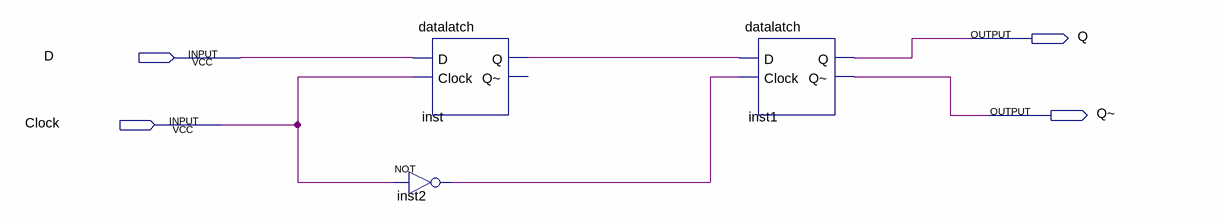
[diagram p0: schematic sheet]
// Quartus schematic NegativeTrigger.bdf as structural Verilog: 3 symbols, 4 pins
module NegativeTrigger (
  input  D,
  input  Clock,
  output Q,
  output \Q~ 
);

  wire inst2_out, inst_q;

  datalatch inst (.D(D), .Clock(Clock), .Q(inst_q));  // open: Q~
  not inst2 (inst2_out, Clock);
  datalatch inst1 (.D(inst_q), .Clock(inst2_out), .Q(Q), .\Q~ (\Q~ ));
endmodule
